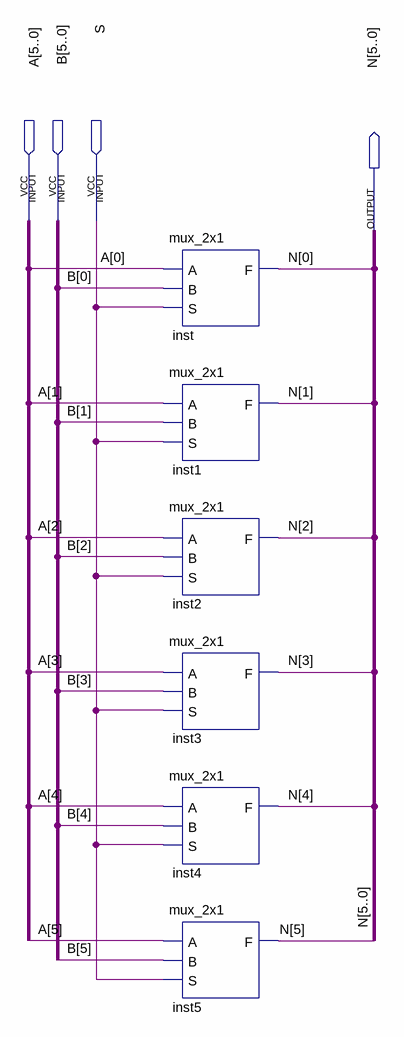
[diagram p0: schematic sheet]
// Quartus schematic mux_12x6.bdf as structural Verilog: 6 symbols, 4 pins
module mux_12x6 (
  input  [5:0] A,
  input  [5:0] B,
  input  S,
  output [5:0] N
);

  mux_2x1 inst (.A(A[0]), .B(B[0]), .S(S), .F(N[0]));
  mux_2x1 inst1 (.A(A[1]), .B(B[1]), .S(S), .F(N[1]));
  mux_2x1 inst2 (.A(A[2]), .B(B[2]), .S(S), .F(N[2]));
  mux_2x1 inst3 (.A(A[3]), .B(B[3]), .S(S), .F(N[3]));
  mux_2x1 inst4 (.A(A[4]), .B(B[4]), .S(S), .F(N[4]));
  mux_2x1 inst5 (.A(A[5]), .B(B[5]), .S(S), .F(N[5]));
endmodule
